# Altium project MIXR Power.PrjPcb (part 1 of 2)
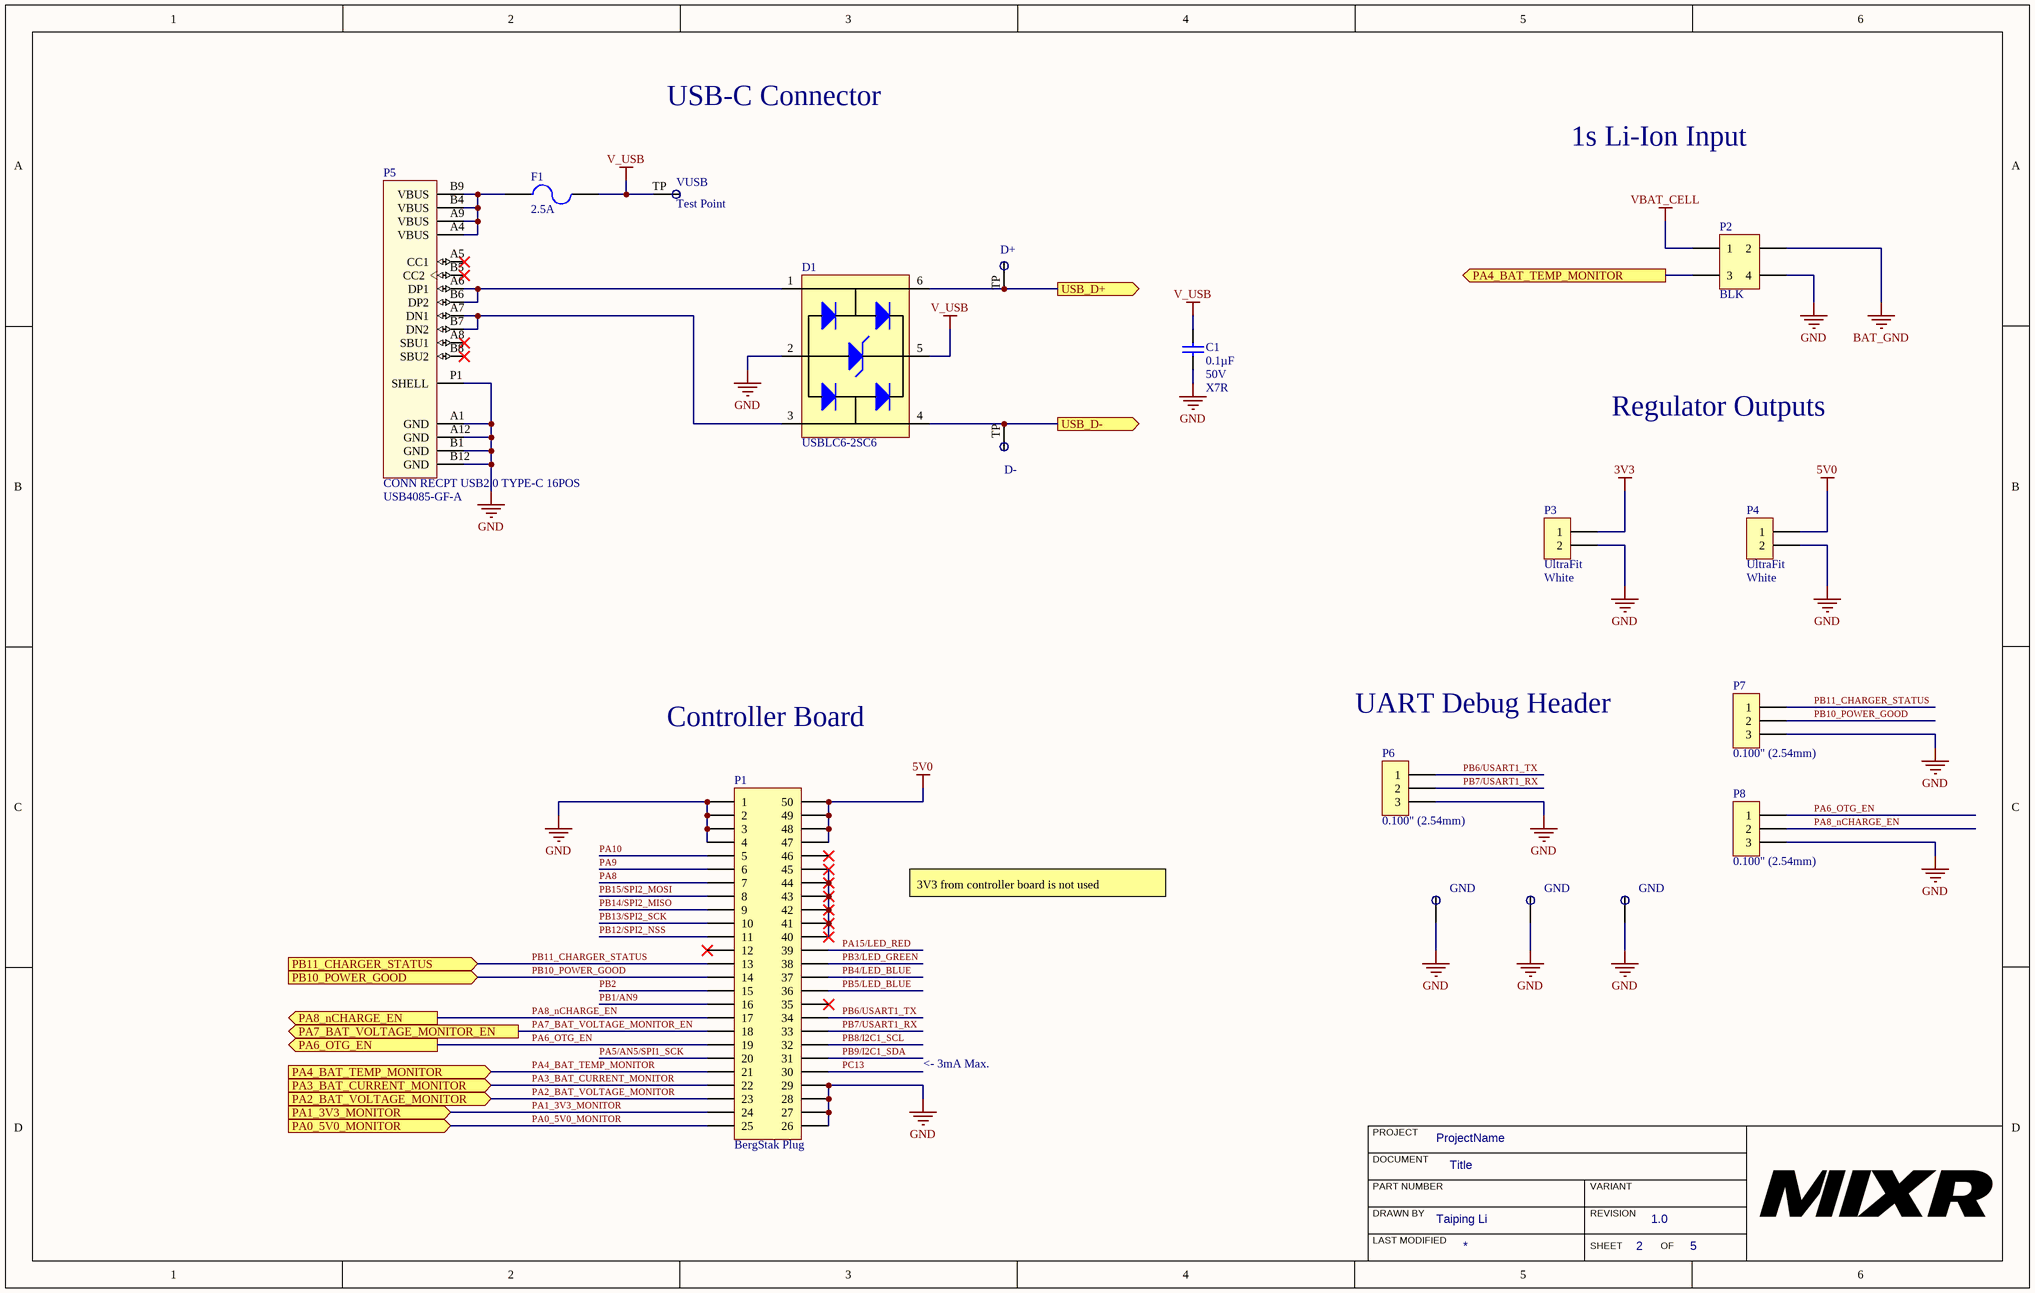
[diagram p0: MIXR Power - Connectors.SchDoc]
ProjectAuthor: Taiping Li; ProjectRevision: 1.0
5 sheets, 89 parts. Net scope: flat (ports and power ports of the same name join across sheets).
Board file: MIXR Power.PcbDoc
Sheets:
  MIXR Power - Block Diagram.SchDoc
  MIXR Power - Connectors.SchDoc
  MIXR Power - Battery Charging.SchDoc
  MIXR Power - Battery Management System.SchDoc
  MIXR Power - Regulators.SchDoc

## Sheet MIXR Power - Block Diagram.SchDoc: Title
size B; Organization: Midnight Sun Solar Rayce Car Team; Address1: University of Waterloo; Address2: 200 University Ave W; Address3: Waterloo, ON, Canada; Address4: N2L 3E9; DocumentNumber: 1; SheetNumber: 1; SheetTotal: 5; Website: www.uwmidsun.com; ProjectName: ProjectName

### Notes on the sheet
- PROJECT
- DOCUMENT
- DRAWN BY
- LAST MODIFIED
- PART NUMBER
- REVISION
- SHEET
- VARIANT
- OF

## Sheet MIXR Power - Connectors.SchDoc: Title
size B; Organization: Midnight Sun Solar Rayce Car Team; Address1: University of Waterloo; Address2: 200 University Ave W; Address3: Waterloo, ON, Canada; Address4: N2L 3E9; DocumentNumber: 2; SheetNumber: 2; SheetTotal: 5; Website: www.uwmidsun.com; ProjectName: ProjectName

### Parts
(Parts that share a designator on the sheet are numbered #1, #2 ... from top to bottom, then left to right.)
C1  Capacitance: 0.1µF  Voltage: 50V  Temperature Coefficient: X7R  [CAP, 0603]  (hidden comment: CAP CER 0.1UF 50V 10% X7R 0603)
D1  Manufacturer Part Number 1: USBLC6-2SC6  [SOT23-6]  (hidden comment: DIODE TVS 5.25V 17V SOT23-6)
D+  Test Point  [Test Point]  (value not drawn)  (no BOM)
D-  Test Point  [Test Point]  (value not drawn)  (no BOM)
F1  Current Rating: 2.5A  [FUSE LITTLEFUSE 0466 1206]  (hidden comment: FUSE 2.5A 32VDC 1206)
GND#1  Thru Test Point  [Thru Test Point]  (value not drawn)
GND#2  Thru Test Point  [Thru Test Point]  (value not drawn)
GND#3  Thru Test Point  [Thru Test Point]  (value not drawn)
P1  Series: BergStak Plug  [CONN, Bergstak 50 Pos Plug]  (hidden comment: CONN 50POS Bergstak Plug 0.02")
P2  BLK  [CONN, 4POS 2 ROW ULTRA-FIT]
P3  Series: UltraFit  Color: White  [CONN, 2POS ULTRA-FIT - NATURAL COLOR]  (hidden comment: CONN 2POS ULTRA-FIT NATURAL COLOR 0.138")
P4  Series: UltraFit  Color: White  [CONN, 2POS ULTRA-FIT - NATURAL COLOR]  (hidden comment: CONN 2POS ULTRA-FIT NATURAL COLOR 0.138")
P5  CONN RECPT USB2.0 TYPE-C 16POS  Manufacturer Part Number: USB4085-GF-A  [CONN RECPT USB2.0 TYPE C 16-POS]
P6  Pitch - Mating: 0.100" (2.54mm)  [CONN, 3POS 0.100" Header, 1 ROW]  (hidden comment: CONN 3POS HEADR MALE 0.1")
P7  Pitch - Mating: 0.100" (2.54mm)  [CONN, 3POS 0.100" Header, 1 ROW]  (hidden comment: CONN 3POS HEADR MALE 0.1")
P8  Pitch - Mating: 0.100" (2.54mm)  [CONN, 3POS 0.100" Header, 1 ROW]  (hidden comment: CONN 3POS HEADR MALE 0.1")
VUSB  Test Point  [Test Point]  (no BOM)

### Ports
PA0_5V0_MONITOR (in), PA1_3V3_MONITOR (in), PA2_BAT_VOLTAGE_MONITOR (in), PA3_BAT_CURRENT_MONITOR (in), PA4_BAT_TEMP_MONITOR (in), PA4_BAT_TEMP_MONITOR (out), PA6_OTG_EN (out), PA7_BAT_VOLTAGE_MONITOR_EN (out), PA8_nCHARGE_EN (out), PB10_POWER_GOOD (in), PB11_CHARGER_STATUS (in), USB_D+ (out), USB_D- (out)

### Nets
3V3: P3.1
5V0: P1.47 P1.48 P1.49 P1.50 P4.1
BAT_GND: P2.2
GND: C1.2 D1.2(Cathode2) GND#1.TH_TP GND#2.TH_TP GND#3.TH_TP P1.1 P1.2 P1.3 P1.4 P1.26 P1.27 P1.28 P1.29 P2.4 P3.2 P4.2 P5.A1(GND) P5.A12(GND) P5.B1(GND) P5.B12(GND) P5.P1(SHELL) P6.3 P7.3 P8.3
V_USB: C1.1 D1.5(Cathode4) F1.2 VUSB.TP
VBAT_CELL: P2.1
PA0_5V0_MONITOR: P1.25 ; port PA0_5V0_MONITOR
PA1_3V3_MONITOR: P1.24 ; port PA1_3V3_MONITOR
PA2_BAT_VOLTAGE_MONITOR: P1.23 ; port PA2_BAT_VOLTAGE_MONITOR
PA3_BAT_CURRENT_MONITOR: P1.22 ; port PA3_BAT_CURRENT_MONITOR
PA4_BAT_TEMP_MONITOR: P1.21 P2.3 ; port PA4_BAT_TEMP_MONITOR
PA5/AN5/SPI1_SCK: P1.20  [project net PA5/AN5/SPI1_SCK_2]
PA6_OTG_EN: P1.19 P8.1 ; port PA6_OTG_EN
PA7_BAT_VOLTAGE_MONITOR_EN: P1.18 ; port PA7_BAT_VOLTAGE_MONITOR_EN
PA8: P1.7  [project net PA8_2]
PA8_nCHARGE_EN: P1.17 P8.2 ; port PA8_nCHARGE_EN
PA9: P1.6  [project net PA9_2]
PA10: P1.5  [project net PA10_2]
PA15/LED_RED: P1.39  [project net PA15/LED_RED_2]
PB1/AN9: P1.16  [project net PB1/AN9_2]
PB2: P1.15  [project net PB2_2]
PB3/LED_GREEN: P1.38  [project net PB3/LED_GREEN_2]
PB4/LED_BLUE: P1.37  [project net PB4/LED_BLUE_2]
PB5/LED_BLUE: P1.36  [project net PB5/LED_BLUE_2]
PB6/USART1_TX: P1.34 P6.1  [project net PB6/USART1_TX_2]
PB7/USART1_RX: P1.33 P6.2  [project net PB7/USART1_RX_2]
PB8/I2C1_SCL: P1.32  [project net PB8/I2C1_SCL_2]
PB9/I2C1_SDA: P1.31  [project net PB9/I2C1_SDA_2]
PB10_POWER_GOOD: P1.14 P7.2 ; port PB10_POWER_GOOD
PB11_CHARGER_STATUS: P1.13 P7.1 ; port PB11_CHARGER_STATUS
PB12/SPI2_NSS: P1.11  [project net PB12/SPI2_NSS_2]
PB13/SPI2_SCK: P1.10  [project net PB13/SPI2_SCK_2]
PB14/SPI2_MISO: P1.9  [project net PB14/SPI2_MISO_2]
PB15/SPI2_MOSI: P1.8  [project net PB15/SPI2_MOSI_2]
PC13: P1.30  [project net PC13_2]
NetD1_1: D1.1(Cathode3) P5.A6(DP1) P5.B6(DP2)
NetD1_3: D1.3(Cathode1) P5.A7(DN1) P5.B7(DN2)
NetD1_4: D1.4(Cathode2) D-.TP ; port USB_D-
NetD1_6: D1.6(Cathode3) D+.TP ; port USB_D+
NetF1_1: F1.1 P5.A4(VBUS) P5.A9(VBUS) P5.B4(VBUS) P5.B9(VBUS)
NetP1_40: P1.40 P1.41 P1.42 P1.43 P1.44 P1.45

Not connected (* = marked no-connect by the designer): P1 12* 35* 46*; P5 A5(CC1)* A8(SBU1)* B5(CC2)* B8(SBU2)*

### Notes on the sheet
- USB-C Connector
- 1s Li-Ion Input
- Regulator Outputs
- Controller Board
- UART Debug Header
- 3V3 from controller board is not used
- <- 3mA Max.
- PROJECT
- DOCUMENT
- DRAWN BY
- LAST MODIFIED
- PART NUMBER
- REVISION
- SHEET
- VARIANT
- OF

### Library data of the parts
C1 = CAP CER 0.1UF 50V 10% X7R 0603: 0.10µF ±10% 50V Ceramic Capacitor X7R 0603 (1608 Metric); Manufacturer 1: AVX Corporation; Manufacturer Part Number 1: 06035C104KAT2A; Supplier 1: Digi-Key; Supplier Part Number 1: 478-5052-1-ND; Packaging: Cut Tape (CT); Part Status: Active; Operating Temperature: -55°C ~ 125°C; Ratings: -; Mounting Type: Surface Mount, MLCC; Package / Case: 0603 (1608 Metric); Size / Dimension: 0.063" L x 0.032" W (1.60mm x 0.81mm); Height - Seated (Max): -; Thickness (Max): 0.035" (0.90mm); Lead Spacing: -; Lead Style: -; ComponentLink1URL: http://datasheets.avx.com/X7RDielectric.pdf; ComponentLink1Description: http://datasheets.avx.com/X7RDielectric.pdf; Tolerance: ±10%
D1 = DIODE TVS 5.25V 17V SOT23-6: 17V Clamp 5A (8/20µs) Ipp Tvs Diode Surface Mount SOT-23-6; Manufacturer 1: STMicroelectronics; Data Rate: 480Mbps; Direction: Unidirectional; Capacitance: 3.5pF; Operating Supply Voltage: 1.1V; Number of Elements: 1; Number of Channels: 2; Reverse Breakdown Voltage: 6V; Working Voltage: 5V; Power Line Protection: Yes; Test Current: 1mA; Max Reverse Leakage Current: 150nA; Element Configuration: Dual; Supplier 1: Digi-Key; Stock 1: 7579; Pricing 1: 1=0.47000, 10=0.39900, 100=0.29820, 500=0.23430, 1000=0.18105 (USD); RoHS: Yes; Mount: Surface Mount; Case/Package: SOT-23; Number of Pins: 6; Contact Plating: Tin; Min Operating Temperature: -40°C; Max Operating Temperature: 125°C; Packaging: Tape and Reel; Package Quantity: 3000; Polarity: Unidirectional; Breakdown Voltage: 6V; Clamping Voltage: 17V; Termination: SMD/SMT; Number of Bidirectional Channels: 2; Reverse Standoff Voltage: 5.25V; Min Breakdown Voltage: 6V; ESD Protection: Yes; Max Breakdown Voltage: 6V; Leakage Current: 150nA; Peak Pulse Current: 5A; Length: 3.05mm; Height: 1.3mm; Width: 1.75mm; Depth: 1.75mm; Radiation Hardening: No; REACH SVHC: No SVHC; Lead Free: Lead Free; ComponentLink1URL: https://datasheet.ciiva.com/1268/1690354-1268384.pdf?src-supplier=Element14; ComponentLink1Description: https://datasheet.ciiva.com/1268/1690354-1268384.pdf?src-supplier=Element14; ComponentLink2URL: https://datasheet.ciiva.com/4508/cd00050750-113117-4508433.pdf?src-supplier=Mouser; ComponentLink2Description: https://datasheet.ciiva.com/4508/cd00050750-113117-4508433.pdf?src-supplier=Mouser; ComponentLink3URL: https://datasheet.ciiva.com/15143/getdatasheetpartid-148465-15143789.pdf?src-supplier=Verical; ComponentLink3Description: https://datasheet.ciiva.com/15143/getdatasheetpartid-148465-15143789.pdf?src-supplier=Verical; ComponentLink4URL: https://datasheet.ciiva.com/26787/usblc6-2sc6-26787908.pdf?src-supplier=IIIC; ComponentLink4Description: https://datasheet.ciiva.com/26787/usblc6-2sc6-26787908.pdf?src-supplier=IIIC; ComponentLink5URL: https://datasheet.ciiva.com/16200/cd00050750-16200026.pdf?src-supplier=Future+Electronics; ComponentLink5Description: https://datasheet.ciiva.com/16200/cd00050750-16200026.pdf?src-supplier=Future+Electronics; ComponentLink6URL: https://datasheet.ciiva.com/41444/001184109-da-01-en-ic-esd-protecti-usblc6-2sc6-sot-23-6-stm-41444156.pdf?src-supplier=Conrad; ComponentLink6Description: https://datasheet.ciiva.com/41444/001184109-da-01-en-ic-esd-protecti-usblc6-2sc6-sot-23-6-stm-41444156.pdf?src-supplier=Conrad; Supplier Part Number 1: 497-5235-1-ND
F1 = FUSE 2.5A 32VDC 1206: 2.5A 32V AC 32V DC Fuse Board Mount (Cartridge Style Excluded) Surface Mount 1206 (3216 Metric); Manufacturer 1: Littelfuse; Manufacturer Part Number 1: 046602.5NRHF; DC Cold Resistance: 24mR; Power Dissipation: 192.5mW; Approvals: UL; Supplier 1: Digi-Key; Stock 1: 4995; Pricing 1: 1=0.84000, 5=0.81200, 10=0.78700, 50=0.66180, 100=0.54930, 250=0.49940, 500=0.42450, 1000=0.37455 (USD); RoHS: Yes; Mount: Surface Mount; Case/Package: 1206; Case Code (Metric): 3216; Case Code (Imperial): 1206; Housing Material: Ceramic; Min Operating Temperature: -55°C; Max Operating Temperature: 90°C; Package Quantity: 5000; Voltage Rating (AC): 32V; Voltage Rating (DC): 32V; Packaging: Tape and Reel; Working Voltage: 32V; Fuse Type: Board Mount (Cartridge Style Excluded); Length: 3.18mm; Height: 0.023inch; Width: 0.06inch; Depth: 1.52mm; Lead Free: Lead Free; ComponentLink1URL: https://datasheet.ciiva.com/303/littelfuse-fuse-466-303217.pdf?src-supplier=Digi-Key; ComponentLink1Description: https://datasheet.ciiva.com/303/littelfuse-fuse-466-303217.pdf?src-supplier=Digi-Key; ComponentLink2URL: https://datasheet.ciiva.com/18652/littelfuse-fuse-466-datasheet-pdf-18652469.pdf?src-supplier=Digi-Key; ComponentLink2Description: https://datasheet.ciiva.com/18652/littelfuse-fuse-466-datasheet-pdf-18652469.pdf?src-supplier=Digi-Key; ComponentLink3URL: https://datasheet.ciiva.com/16327/littelfuse-fuse-466-16327471.pdf?src-supplier=Future+Electronics; ComponentLink3Description: https://datasheet.ciiva.com/16327/littelfuse-fuse-466-16327471.pdf?src-supplier=Future+Electronics; Supplier Part Number 1: F6143CT-ND
P1 = CONN 50POS Bergstak Plug 0.02": 50 Position Connector Plug, Outer Shroud Contacts Surface Mount Gold; Manufacturer 1: Amphenol FCI; Manufacturer Part Number 1: 10132797-055100LF; Number of Positions: 50; Mated Stacking Heights: 5mm; Pitch: 0.020" (0.50mm); Supplier 1: Digi-Key; Supplier Part Number 1: 609-5226-1-ND; Packaging: Cut Tape (CT); Part Status: Active; Connector Type: Plug, Outer Shroud Contacts; Number of Rows: 2; Mounting Type: Surface Mount; Contact Finish: Gold; Contact Finish Thickness: 1µin (0.025µm); Height Above Board: 0.169" (4.30mm); ComponentLink1URL: http://portal.fciconnect.com/Comergent//fci/drawing/10132797.pdf; ComponentLink1Description: http://portal.fciconnect.com/Comergent//fci/drawing/10132797.pdf
P2 = CONN 4POS 2 ROW ULTRA-FIT 0.138": Connector Header Through Hole 4 position 0.138" (3.50mm); Manufacturer 1: Molex; Manufacturer Part Number 1: 1722991104; Description 1: ULTRA-FIT HDR VT DUAL F BLK 04CKT TIN; Number of Positions: 4; Connector Type: Male Pin; Pitch: 0.138inch; Row Spacing: 0.181inch; Supplier 1: Digi-Key; Supplier Part Number 1: WM11777-ND; Stock 1: 958; Pricing 1: 1=0.86, 10=0.753, 100=0.6494, 500=0.53136, 1000=0.47232, 5000=0.41328, 10000=0.39262 (USD); Mount: Through Hole; Colour: Black; Contact Plating: Tin; Packaging: Tray; Number of Rows: 2; Termination: Solder; Fastening Type: Latch; ComponentLink1URL: http://www.literature.molex.com/SQLImages/kelmscott/Molex/PDF_Images/987651-1008.pdf; ComponentLink1Description: http://www.literature.molex.com/SQLImages/kelmscott/Molex/PDF_Images/987651-1008.pdf
P3 P4 = CONN 2POS ULTRA-FIT NATURAL COLOR 0.138": 2 Positions Header, Shrouded Connector 0.138" (3.50mm) Through Hole; Manufacturer 1: Molex, LLC; Manufacturer Part Number 1: 1722872102; Style: Board to Cable/Wire; Shrouding: Shrouded - 4 Wall; Number of Positions: 2; Number of Positions Loaded: All; Contact Length - Post: 0.126" (3.20mm); Material Flammability Rating: UL94 V-0; Mated Stacking Heights: 26.99mm; Voltage: 400V; Supplier 1: Digi-Key; Supplier Part Number 1: WM11722-ND; Packaging: Tray; Part Status: Active; Connector Type: Header; Contact Type: Male Pin; Pitch - Mating: 0.138" (3.50mm); Number of Rows: 1; Row Spacing - Mating: -; Mounting Type: Through Hole; Termination: Solder; Fastening Type: Latch Holder; Contact Length - Mating: -; Overall Contact Length: -; Insulation Height: 0.465" (11.80mm); Contact Shape: Square; Contact Finish - Mating: Tin; Contact Finish Thickness - Mating: 60µin (1.52µm); Contact Finish - Post: Tin; Contact Material: Copper Alloy; Insulation Material: Liquid Crystal Polymer (LCP); Operating Temperature: -40°C ~ 105°C; Ingress Protection: -; Insulation Color: Natural; Current Rating: -; Contact Finish Thickness - Post: 60µin (1.52µm); ComponentLink1URL: http://www.molex.com/pdm_docs/sd/1722872102_sd.pdf; ComponentLink1Description: http://www.molex.com/pdm_docs/sd/1722872102_sd.pdf
P5 = CONN RECPT USB2.0 TYPE-C 16POS: USB - C USB 2.0 Receptacle Connector 16 Position Through Hole, Right Angle; Manufacturer: Global Connector Technology; Supplier 1: Digi-Key; Supplier Part Number 1: 2073-USB4085-GF-ACT-ND; Stock 1: 286; Pricing 1: 1 = 1.440000, 10 = 1.307000, 25 = 1.227200, 50 = 1.174000, 100 = 1.120600, 250 = 1.013840 (USD); RoHS: No
P6-P8 = CONN 3POS HEADR MALE 0.1": 3 Positions Header Connector 0.100" (2.54mm) Through Hole Gold; Manufacturer 1: Wurth Electronics Inc.; Manufacturer Part Number 1: 61300311121; Style: Board to Board or Cable; Shrouding: Unshrouded; Number of Positions: 3; Number of Positions Loaded: All; Contact Length - Mating: 0.236" (6.00mm); Contact Length - Post: 0.118" (3.00mm); Overall Contact Length: 0.454" (11.54mm); Material Flammability Rating: UL94 V-0; Current Rating: 3A; Voltage: 250V; Supplier 1: Digi-Key; Supplier Part Number 1: 732-5316-ND; Packaging: Bulk; Part Status: Active; Connector Type: Header; Contact Type: Male Pin; Number of Rows: 1; Row Spacing - Mating: -; Mounting Type: Through Hole; Termination: Solder; Fastening Type: -; Insulation Height: 0.100" (2.54mm); Contact Shape: Square; Contact Finish - Mating: Gold; Contact Finish Thickness - Mating: -; Contact Finish - Post: -; Contact Material: Copper Alloy; Insulation Material: Polybutylene Terephthalate (PBT); Operating Temperature: -40°C ~ 125°C; Ingress Protection: -; Insulation Color: Black; Mated Stacking Heights: -; Contact Finish Thickness - Post: -; ComponentLink1URL: http://katalog.we-online.de/em/datasheet/6130xx11121.pdf; ComponentLink1Description: http://katalog.we-online.de/em/datasheet/6130xx11121.pdf

## Sheet MIXR Power - Battery Charging.SchDoc: Title
size B; Organization: Midnight Sun Solar Rayce Car Team; Address1: University of Waterloo; Address2: 200 University Ave W; Address3: Waterloo, ON, Canada; Address4: N2L 3E9; DocumentNumber: 3; SheetNumber: 3; SheetTotal: 5; Website: www.uwmidsun.com; ProjectName: ProjectName
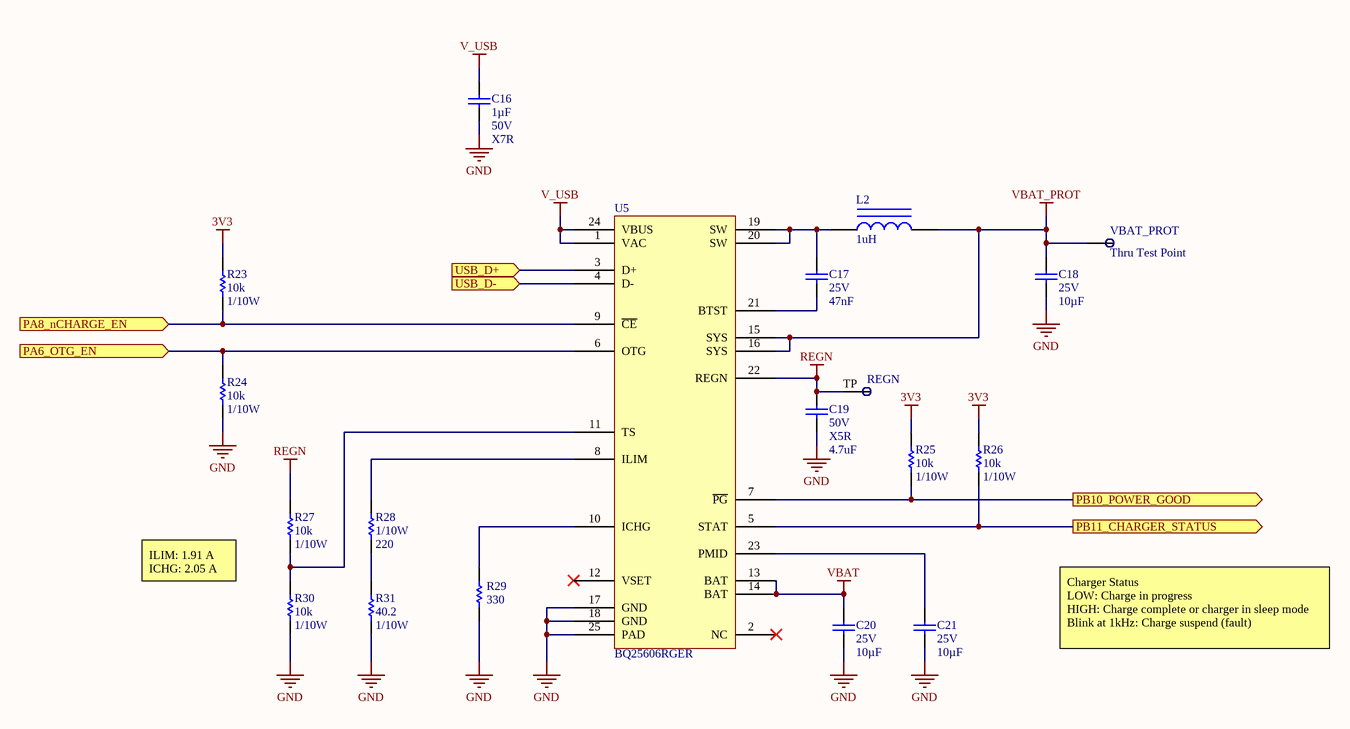
[diagram p1: MIXR Power - Battery Charging.SchDoc]

### Parts
C16  Capacitance: 1µF  Voltage: 50V  Temperature Coefficient: X7R  [CAP, 0603]  (hidden comment: CAP CER 1UF 50V 10% X7R 0603)
C17  Voltage: 25V  Capacitance: 47nF  [CAP, 0603]  (hidden comment: CAP CER 0.047UF 10% 25V X7R 0603)
C18  Voltage - Rated: 25V  Capacitance: 10µF  [CAP, 0805]  (hidden comment: CAP CER 10uF 25V 10% X5R 0805)
C19  value 4.7uF  Voltage - Rated: 50V  Temperature Coefficient: X5R  [CAP, 0805]  (hidden comment: CAP CER 4.7UF 50V 10% X5R 0805)
C20  Voltage - Rated: 25V  Capacitance: 10µF  [CAP, 0805]  (hidden comment: CAP CER 10uF 25V 10% X5R 0805)
C21  Voltage - Rated: 25V  Capacitance: 10µF  [CAP, 0805]  (hidden comment: CAP CER 10uF 25V 10% X5R 0805)
L2  Inductance: 1uH  [IND 1uH 3.8A 25 MOHM SMD]  (hidden comment: IND 1uH 3.8A 25 MOHM SMD)
R23  Resistance: 10k  Power: 1/10W  [RES, 0603]  (hidden comment: RES 10K OHM 1% 1/10W 0603)
R24  Resistance: 10k  Power: 1/10W  [RES, 0603]  (hidden comment: RES 10K OHM 1% 1/10W 0603)
R25  Resistance: 10k  Power: 1/10W  [RES, 0603]  (hidden comment: RES 10K OHM 1% 1/10W 0603)
R26  Resistance: 10k  Power: 1/10W  [RES, 0603]  (hidden comment: RES 10K OHM 1% 1/10W 0603)
R27  Resistance: 10k  Power: 1/10W  [RES, 0603]  (hidden comment: RES 10K OHM 1% 1/10W 0603)
R28  Power (Watts): 1/10W  Resistance: 220  [RES, 0603]  (hidden comment: RES 220 OHM 1% 1/10W 0603)
R29  value 330  [RES, 0603]  (hidden comment: RES 330 OHM 1% 1/10W 0603)
R30  Resistance: 10k  Power: 1/10W  [RES, 0603]  (hidden comment: RES 10K OHM 1% 1/10W 0603)
R31  Resistance: 40.2  Power: 1/10W  [RES, 0603]  (hidden comment: RES 40.2 OHM 0.5% 1/10W 0603)
REGN  Test Point  [Test Point]  (value not drawn)  (no BOM)
U5  Manufacturer Part Number: BQ25606RGER  [IC BATT CHG LI-ION 1 CELL 24-VQFN]  (hidden comment: IC BATT CHG LI-ION 1 CELL 24-VQFN)
VBAT_PROT  Thru Test Point  [Thru Test Point]

### Ports
PA6_OTG_EN (in), PA8_nCHARGE_EN (in), PB10_POWER_GOOD (out), PB11_CHARGER_STATUS (out), USB_D+ (in), USB_D- (in)

### Nets
3V3: R23.1 R25.1 R26.1
GND: C16.2 C18.2 C19.2 C20.2 C21.2 R24.2 R29.2 R30.2 R31.2 U5.17(GND) U5.18(GND) U5.25(PAD)
REGN: C19.1 R27.1 REGN.TP U5.22(REGN)
V_USB: C16.1 U5.1(VAC) U5.24(VBUS)
VBAT: C20.1 U5.13(BAT) U5.14(BAT)
VBAT_PROT: C18.1 L2.2 U5.15(SYS) U5.16(SYS) VBAT_PROT.TH_TP
PA6_OTG_EN: R24.1 U5.6(OTG) ; port PA6_OTG_EN
PA8_nCHARGE_EN: R23.2 U5.9(~{CE}) ; port PA8_nCHARGE_EN
PB10_POWER_GOOD: R25.2 U5.7(~{PG}) ; port PB10_POWER_GOOD
PB11_CHARGER_STATUS: R26.2 U5.5(STAT) ; port PB11_CHARGER_STATUS
NetC17_1: C17.1 L2.1 U5.19(SW) U5.20(SW)
NetC17_2: C17.2 U5.21(BTST)
NetC21_1: C21.1 U5.23(PMID)
NetD1_4: U5.4(D-) ; port USB_D-
NetD1_6: U5.3(D+) ; port USB_D+
NetR27_2: R27.2 R30.1 U5.11(TS)
NetR28_1: R28.1 U5.8(ILIM)
NetR28_2: R28.2 R31.1
NetR29_1: R29.1 U5.10(ICHG)

Not connected (* = marked no-connect by the designer): U5 2(NC)* 12(VSET)*

### Notes on the sheet
- ILIM: 1.91 A
  ICHG: 2.05 A
- Charger Status
  LOW: Charge in progress
  HIGH: Charge complete or charger in sleep mode
  Blink at 1kHz: Charge suspend (fault)
- PROJECT
- DOCUMENT
- DRAWN BY
- LAST MODIFIED
- PART NUMBER
- REVISION
- SHEET
- VARIANT
- OF

### Library data of the parts
C16 = CAP CER 1UF 50V 10% X7R 0603: 1µF ±10% 50V Ceramic Capacitor X7R 0603 (1608 Metric); Manufacturer 1: Taiyo Yuden; Manufacturer Part Number 1: UMK107AB7105KA-T; Supplier 1: Digi-Key; Supplier Part Number 1: 587-3247-1-ND; Packaging: Cut Tape (CT); Part Status: Active; Operating Temperature: -55°C ~ 125°C; Ratings: -; Mounting Type: Surface Mount, MLCC; Package / Case: 0603 (1608 Metric); Size / Dimension: 0.063" L x 0.031" W (1.60mm x 0.80mm); Height - Seated (Max): -; Thickness (Max): 0.037" (0.95mm); Lead Spacing: -; Lead Style: -; ComponentLink1URL: http://www.yuden.co.jp/productdata/catalog/en/mlcc_all_e.pdf; ComponentLink1Description: http://www.yuden.co.jp/productdata/catalog/en/mlcc_all_e.pdf; Tolerance: ±10%
C17 = CAP CER 0.047UF 10% 25V X7R 0603: 0.047µF ±10% 25V Ceramic Capacitor X7R 0603 (1608 Metric) /; Manufacturer: KEMET; Manufacturer Part Number: C0603C473K3RACTU; Supplier 1: Digi-Key; Supplier Part Number 1: 399-7931-1-ND; Stock 1: 1163581; Pricing 1: 1 = 0.11000, 10 = 0.07800, 100 = 0.03650, 500 = 0.02562, 1000 = 0.02121 (USD); RoHS: Yes; Mount: Surface Mount; Case/Package: 0603; Dielectric Material: Ceramic; Contact Plating: Tin; Min Operating Temperature: -55°C; Max Operating Temperature: 125°C; Tolerance: 10%; Packaging: Tape and Reel; Dielectric: X7R; Termination: SMD/SMT; Voltage Rating (DC): 25V; Length: 1.6mm; Height: 0.8mm; Depth: 0.8mm; Radiation Hardening: No; ComponentLink1URL: https://datasheet.ciiva.com/28682/1851736-28682293.pdf?src-supplier=Element14; ComponentLink1Description: https://datasheet.ciiva.com/28682/1851736-28682293.pdf?src-supplier=Element14; ComponentLink2URL: https://datasheet.ciiva.com/28584/1918693-28584138.pdf?src-supplier=Element14; ComponentLink2Description: https://datasheet.ciiva.com/28584/1918693-28584138.pdf?src-supplier=Element14; ComponentLink3URL: https://datasheet.ciiva.com/46445/1851736-46445227.pdf?src-supplier=Element14; ComponentLink3Description: https://datasheet.ciiva.com/46445/1851736-46445227.pdf?src-supplier=Element14; ComponentLink4URL: https://datasheet.ciiva.com/18193/getdatasheetpartid-330260-18193100.pdf?src-supplier=Verical; ComponentLink4Description: https://datasheet.ciiva.com/18193/getdatasheetpartid-330260-18193100.pdf?src-supplier=Verical; ComponentLink5URL: https://datasheet.ciiva.com/7824/kem-c1002-x7r-smd-7824045.pdf?src-supplier=Element14; ComponentLink5Description: https://datasheet.ciiva.com/7824/kem-c1002-x7r-smd-7824045.pdf?src-supplier=Element14
C18 C20 C21 = CAP CER 10uF 25V 10% X5R 0805: 10µF ±10% 25V Ceramic Capacitor X5R 0805 (2012 Metric); Manufacturer: Murata Electronics North America; Manufacturer Part Number: GRM21BR61E106KA73L; Supplier 1: Digi-Key; RoHS: RoHS Compliant; Category: Capacitors; Stock 1: 1695157; Packaging: Cut Tape (CT); Part Status: Active; Tolerance: ±10%; Temperature Coefficient: X5R; Operating Temperature: -55°C ~ 85°C; Features: -; Ratings: -; Applications: General Purpose; Mounting Type: Surface Mount, MLCC; Package / Case: 0805 (2012 Metric); Size / Dimension: 0.079" L x 0.049" W (2.00mm x 1.25mm); Height - Seated (Max): -; Thickness (Max): 0.053" (1.35mm); Lead Spacing: -; Lead Style: -; ComponentLink1URL: http://search.murata.co.jp/Ceramy/image/img/A01X/G101/ENG/GRM21BR61E106KA73-01.pdf; ComponentLink1Description: http://search.murata.co.jp/Ceramy/image/img/A01X/G101/ENG/GRM21BR61E106KA73-01.pdf; Supplier Part Number 1: 490-5523-1-ND; Pricing 1: 1=0.3, 10=0.214, 100=0.1008, 500=0.07068, 1000=0.05851 (CAD)
C19 = CAP CER 4.7UF 50V 10% X5R 0805: 4.7µF ±20% 50V Ceramic Capacitor X5R 0805 (2012 Metric); Manufacturer 1: Murata Electronics North America; Manufacturer Part Number 1: GRT21BR61H475ME13L; Description 1: CAP CER 4.7UF 50V X5R 0805; Supplier 1: Digi-Key; Supplier Part Number 1: 490-12395-1-ND; RoHS: RoHS Compliant; Category: Capacitors; Stock 1: 4286; Pricing 1: 1=0.56, 10=0.389, 100=0.2338, 500=0.17536, 1000=0.14808 (CAD); Packaging: Cut Tape (CT); Part Status: Active; Tolerance: ±20%; Operating Temperature: -55°C ~ 85°C; Features: -; Ratings: AEC-Q200; Applications: Automotive; Mounting Type: Surface Mount, MLCC; Package / Case: 0805 (2012 Metric); Size / Dimension: 0.079" L x 0.049" W (2.00mm x 1.25mm); Height - Seated (Max): -; Thickness (Max): 0.057" (1.45mm); Lead Spacing: -; Lead Style: -; ComponentLink1URL: http://search.murata.co.jp/Ceramy/image/img/A01X/G101/ENG/GRT21BR61H475ME13-01.pdf; ComponentLink1Description: http://search.murata.co.jp/Ceramy/image/img/A01X/G101/ENG/GRT21BR61H475ME13-01.pdf
L2 = IND 1uH 3.8A 25 MOHM SMD: 1µH Shielded Inductor 3.8A 25mOhm Max Nonstandard /; Manufacturer: Vishay Dale; Manufacturer Part Number: IFSC1515AHER1R0M01; Tolerance: 20%; DC Resistance (DCR): 25mR; Test Frequency: 100kHz; Supplier 1: Digi-Key; Supplier Part Number 1: 541-1403-1-ND; Stock 1: 59210; Pricing 1: 1 = 0.64000, 10 = 0.55900, 100 = 0.39960, 500 = 0.33568, 1000 = 0.27175 (USD); RoHS: Yes; Mount: Surface Mount; Case/Package: 1515; Number of Pins: 2; Min Operating Temperature: -55°C; Max Operating Temperature: 125°C; Package Quantity: 2000; Current Rating: 3.8A; Saturation Current: 3.8A; Shielding: Shielded; Packaging: Tape and Reel; Inductance Tolerance: 20%; Max DC Current: 3.8A; Termination: SMD/SMT; RMS Current (Irms): 3.8A; Military Standard: Not; Length: 0.15inch; Height: 1.8mm; Width: 0.15inch; Height - Seated (Max): 0.075inch; Depth: 4mm; REACH SVHC: Unknown; Lead Free: Lead Free; ComponentLink1URL: https://datasheet.ciiva.com/1049/sc15ah01-1049408.pdf?src-supplier=Digi-Key; ComponentLink1Description: https://datasheet.ciiva.com/1049/sc15ah01-1049408.pdf?src-supplier=Digi-Key; ComponentLink2URL: https://datasheet.ciiva.com/1049/sc15ah01-1049409.pdf?src-supplier=Digi-Key; ComponentLink2Description: https://datasheet.ciiva.com/1049/sc15ah01-1049409.pdf?src-supplier=Digi-Key; ComponentLink3URL: https://datasheet.ciiva.com/3079/sc15ah01-3079157.pdf?src-supplier=Avnet; ComponentLink3Description: https://datasheet.ciiva.com/3079/sc15ah01-3079157.pdf?src-supplier=Avnet; ComponentLink4URL: https://datasheet.ciiva.com/1049/sc15ah01-1049407.pdf?src-supplier=Digi-Key; ComponentLink4Description: https://datasheet.ciiva.com/1049/sc15ah01-1049407.pdf?src-supplier=Digi-Key; ComponentLink5URL: https://datasheet.ciiva.com/8017/sc15ah01-8017535.pdf?src-supplier=Element14; ComponentLink5Description: https://datasheet.ciiva.com/8017/sc15ah01-8017535.pdf?src-supplier=Element14
R23-R27 R30 = RES 10K OHM 1% 1/10W 0603: RES SMD 10K OHM 1% 1/10W 0603; Manufacturer 1: Yageo; Manufacturer Part Number 1: RC0603FR-0710KL; Temperature Coefficient: ±100ppm/°C; Supplier 1: Digi-Key; Supplier Part Number 1: 311-10.0KHRCT-ND; Packaging: Cut Tape (CT); Part Status: Active; Composition: Thick Film; Operating Temperature: -55°C ~ 155°C; Package / Case: 0603 (1608 Metric); Supplier Device Package: 0603; Size / Dimension: 0.063" L x 0.031" W (1.60mm x 0.80mm); Height - Seated (Max): 0.022" (0.55mm); Failure Rate: -; ComponentLink1URL: http://www.yageo.com/documents/recent/PYu-RC_Group_51_RoHS_L_7.pdf; ComponentLink1Description: http://www.yageo.com/documents/recent/PYu-RC_Group_51_RoHS_L_7.pdf; Tolerance: ±1%
R28 = RES 220 OHM 1% 1/10W 0603: 220 Ohms ±1% 0.1W, 1/10W Chip Resistor 0603 (1608 Metric) Moisture Resistant Thick Film; Manufacturer: Yageo; Manufacturer Part Number: RC0603FR-07220RL; Temperature Coefficient: ±100ppm/°C; Supplier 1: Digi-Key; RoHS: RoHS Compliant; Category: Resistors; Stock 1: 1318812; Pricing 1: 1=0.15, 10=0.022, 100=0.0088, 1000=0.00392, 2500=0.0034 (CAD); Packaging: Cut Tape (CT); Part Status: Active; Tolerance: ±1%; Composition: Thick Film; Features: Moisture Resistant; Operating Temperature: -55°C ~ 155°C; Package / Case: 0603 (1608 Metric); Supplier Device Package: 0603; Size / Dimension: 0.063" L x 0.032" W (1.60mm x 0.80mm); Height - Seated (Max): 0.022" (0.55mm); Failure Rate: -; ComponentLink1URL: http://www.yageo.com/documents/recent/PYu-RC_Group_51_RoHS_L_8.pdf; ComponentLink1Description: http://www.yageo.com/documents/recent/PYu-RC_Group_51_RoHS_L_8.pdf; Supplier Part Number 1: 311-220HRCT-ND
R29 = RES 330 OHM 1% 1/10W 0603: 330 Ohms ±1% 0.1W, 1/10W Chip Resistor 0603 (1608 Metric) Automotive AEC-Q200, Moisture Resistant Thick Film; Manufacturer: TE Connectivity; Manufacturer Part Number: CRGCQ0603F330R; Supplier 1: Digi-Key; Supplier Part Number 1: A129682CT-ND; RoHS: No; Stock 1: 87700; Pricing 1: 1 = 0.10000, 10 = 0.03300, 100 = 0.01320, 1000 = 0.00595, 2500 = 0.00516 (USD); ComponentLink1URL: http://www.te.com/commerce/DocumentDelivery/DDEController?Action=srchrtrv&DocNm=1773204-3&DocType=DS&DocLang=English&src-supplier=Digi-Key; ComponentLink1Description: http://www.te.com/commerce/DocumentDelivery/DDEController?Action=srchrtrv&DocNm=1773204-3&DocType=DS&DocLang=English&src-supplier=Digi-Key; ComponentLink2URL: https://www.te.com/commerce/DocumentDelivery/DDEController?Action=srchrtrv&DocNm=1773204-3&DocType=DS&DocLang=English&src-supplier=Digi-Key; ComponentLink2Description: https://www.te.com/commerce/DocumentDelivery/DDEController?Action=srchrtrv&DocNm=1773204-3&DocType=DS&DocLang=English&src-supplier=Digi-Key
R31 = RES 40.2 OHM 0.5% 1/10W 0603: RES SMD 40.2 OHM 0.5% 1/10W 0603; Manufacturer 1: Yageo; Manufacturer Part Number 1: RT0603DRE0740R2L; Temperature Coefficient: ±50ppm/°C; Supplier 1: Digi-Key; Supplier Part Number 1: 311-2576-1-ND; Packaging: Cut Tape (CT); Part Status: Active; Composition: Thin Film; Operating Temperature: -55°C ~ 155°C; Package / Case: 0603 (1608 Metric); Supplier Device Package: 0603; Size / Dimension: 0.063" L x 0.031" W (1.60mm x 0.80mm); Height - Seated (Max): 0.022" (0.55mm); Failure Rate: -; ComponentLink1URL: http://www.yageo.com/documents/recent/PYu-RT_1-to-0.01_RoHS_L_7.pdf; ComponentLink1Description: http://www.yageo.com/documents/recent/PYu-RT_1-to-0.01_RoHS_L_7.pdf; Tolerance: ±0.5%
U5 = IC BATT CHG LI-ION 1 CELL 24-VQFN: Charger IC Lithium Ion/Polymer 24-VQFN (4x4); Manufacturer: Texas Instruments; Number of Cells: 1; Supplier 1: Digi-Key; Supplier Part Number 1: 296-47743-1-ND; Stock 1: 8983; Pricing 1: 1 = 2.76000, 10 = 2.48100, 100 = 2.03260, 500 = 1.73032, 1000 = 1.45930 (USD); RoHS: No; ComponentLink1URL: http://www.ti.com/lit/ds/symlink/bq25606.pdf?src-supplier=Digi-Key; ComponentLink1Description: http://www.ti.com/lit/ds/symlink/bq25606.pdf?src-supplier=Digi-Key

## Sheet MIXR Power - Battery Management System.SchDoc: Title
size B; Organization: Midnight Sun Solar Rayce Car Team; Address1: University of Waterloo; Address2: 200 University Ave W; Address3: Waterloo, ON, Canada; Address4: N2L 3E9; Website: www.uwmidsun.com; ProjectName: ProjectName
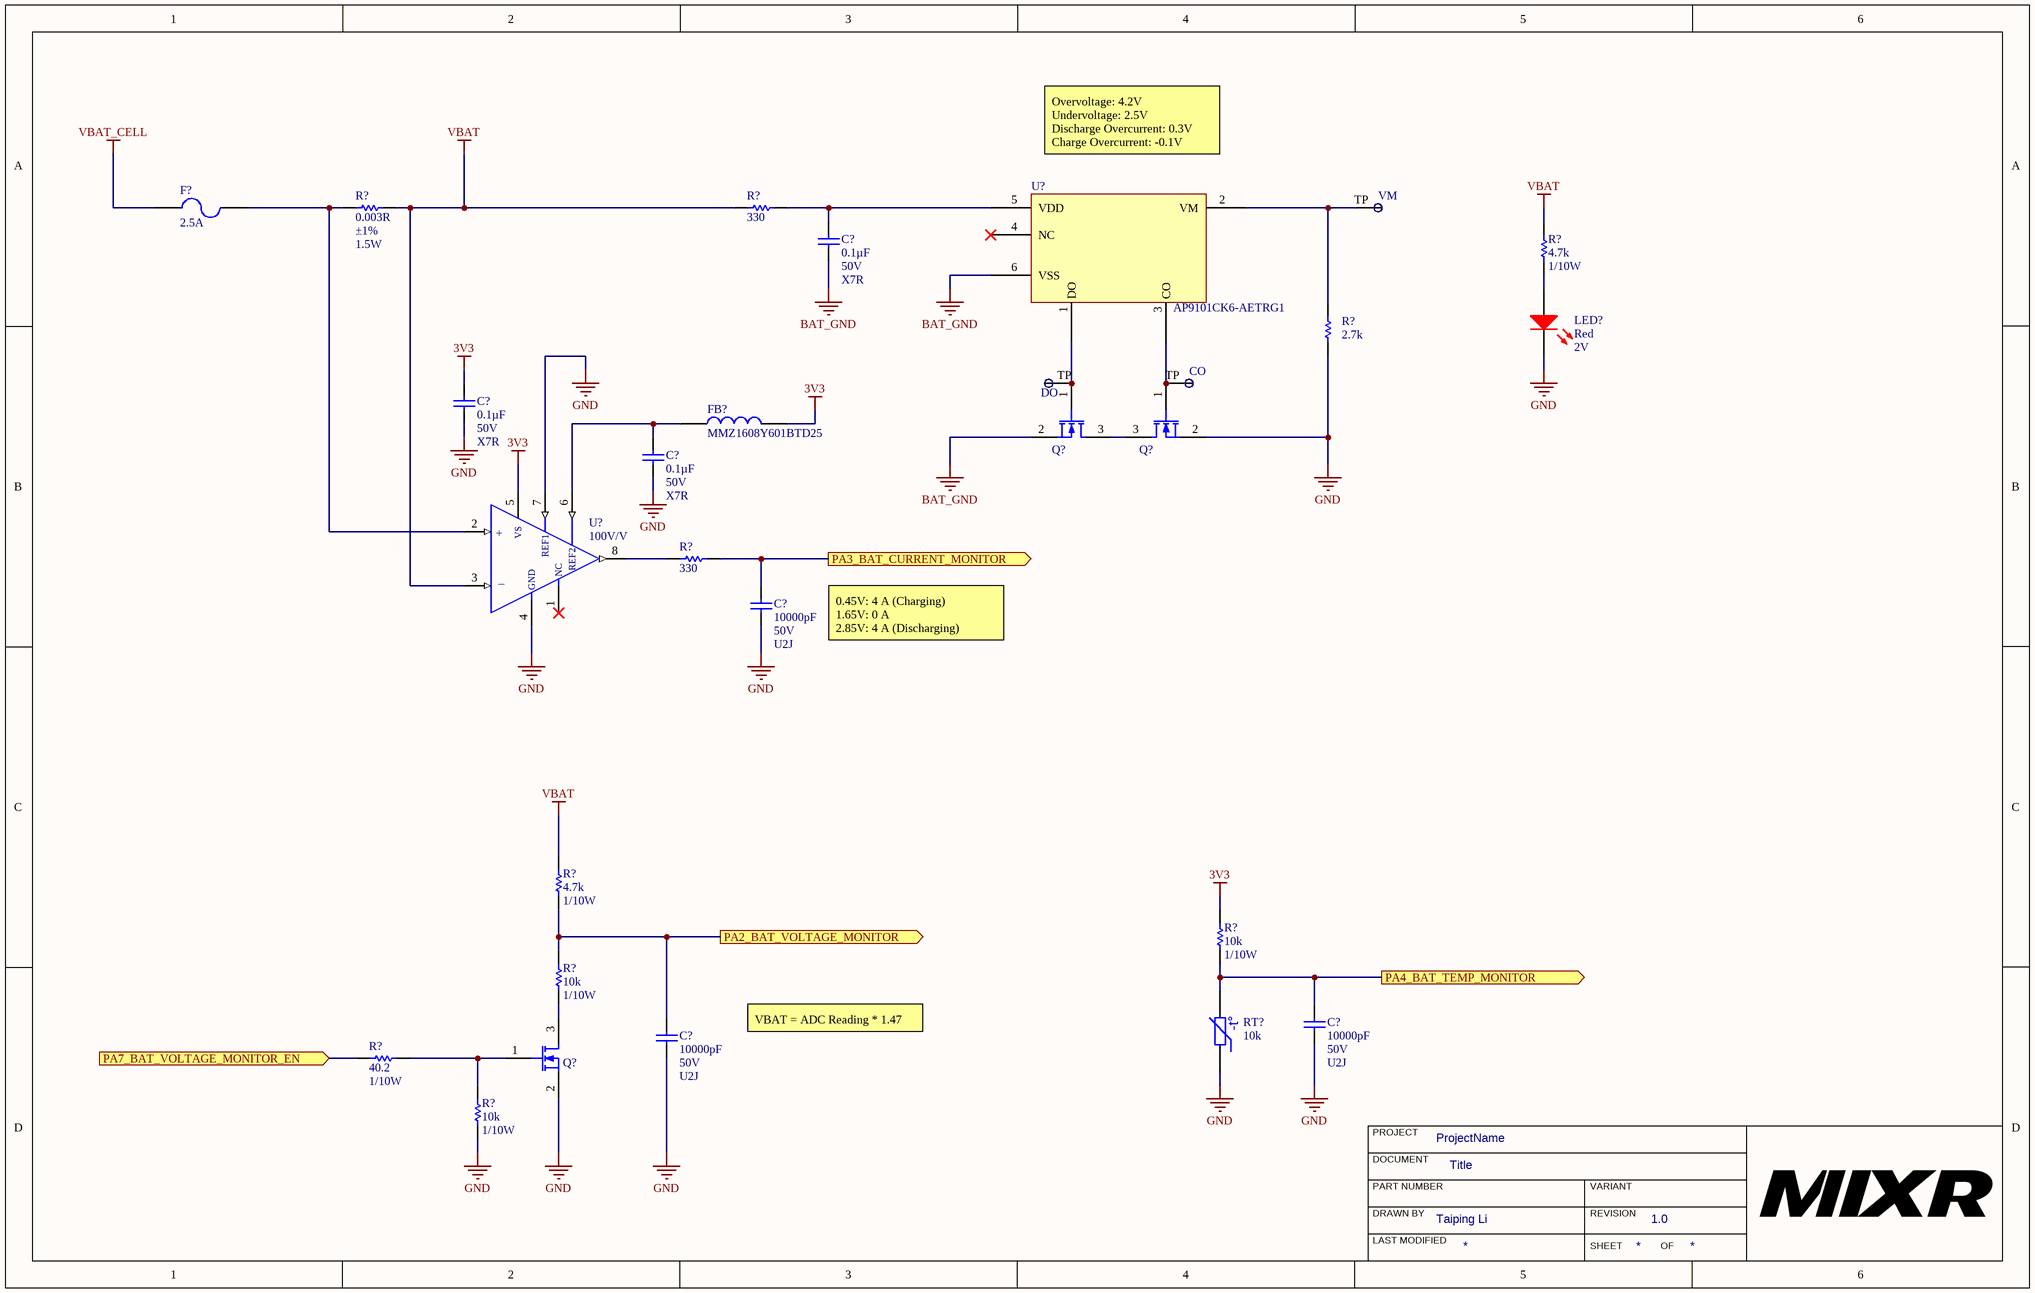
[diagram p2: MIXR Power - Battery Management System.SchDoc]

### Parts
(Parts that share a designator on the sheet are numbered #1, #2 ... from top to bottom, then left to right.)
C?#1  Capacitance: 0.1µF  Voltage: 50V  Temperature Coefficient: X7R  [CAP, 0603]  (hidden comment: CAP CER 0.1UF 50V 10% X7R 0603)
C?#2  Capacitance: 0.1µF  Voltage: 50V  Temperature Coefficient: X7R  [CAP, 0603]  (hidden comment: CAP CER 0.1UF 50V 10% X7R 0603)
C?#3  Capacitance: 0.1µF  Voltage: 50V  Temperature Coefficient: X7R  [CAP, 0603]  (hidden comment: CAP CER 0.1UF 50V 10% X7R 0603)
C?#4  Capacitance: 10000pF  Voltage: 50V  Temperature Coefficient: U2J  [CAP, 0603]  (hidden comment: CAP CER 10nF 50V 5% X7R 0603)
C?#5  Capacitance: 10000pF  Voltage: 50V  Temperature Coefficient: U2J  [CAP, 0603]  (hidden comment: CAP CER 10nF 50V 5% X7R 0603)
C?#6  Capacitance: 10000pF  Voltage: 50V  Temperature Coefficient: U2J  [CAP, 0603]  (hidden comment: CAP CER 10nF 50V 5% X7R 0603)
CO  Test Point  [Test Point]  (value not drawn)  (no BOM)
DO  Test Point  [Test Point]  (value not drawn)  (no BOM)
F?  Current Rating: 2.5A  [FUSE LITTLEFUSE 0466 1206]  (hidden comment: FUSE 2.5A 32VDC 1206)
FB?  Manufacturer Part Number: MMZ1608Y601BTD25  [FB 0603]  (hidden comment: FB 600 OHM 1LN 0603)
LED?#1  Color: Red  Voltage - Forward (Vf) (Typ): 2V  [LED_0603]  (hidden comment: LED RED CLEAR 2V 0603)
Q?#1  MOSFET N-CH 30V 6.2A 0.9W SOT-23  [MOSFET N-CH 30V 6.2A 0.9W SOT-23]  (value not drawn)
Q?#2  MOSFET N-CH 30V 6.2A 0.9W SOT-23  [MOSFET N-CH 30V 6.2A 0.9W SOT-23]  (value not drawn)
Q?#3  MOSFET N-CH 30V 6.2A 0.9W SOT-23  [MOSFET N-CH 30V 6.2A 0.9W SOT-23]  (value not drawn)
R?#1  Resistance (Ohms): 0.003R  Tolerance: ±1%  Power (Watts): 1.5W  [RES 2010]  (hidden comment: RES 0.003 OHM 1% 1.5W 2010)
R?#2  value 330  [RES, 0603]  (hidden comment: RES 330 OHM 1% 1/10W 0603)
R?#3  Resistance (Ohms): 4.7k  Power (Watts): 1/10W  [RES, 0603]  (hidden comment: RES 4.7K OHM 1% 1/10W 0603)
R?#4  2.7k  [RES, 0603]
R?#5  value 330  [RES, 0603]  (hidden comment: RES 330 OHM 1% 1/10W 0603)
R?#6  Resistance (Ohms): 4.7k  Power (Watts): 1/10W  [RES, 0603]  (hidden comment: RES 4.7K OHM 1% 1/10W 0603)
R?#7  Resistance: 10k  Power: 1/10W  [RES, 0603]  (hidden comment: RES 10K OHM 1% 1/10W 0603)
R?#8  Resistance: 10k  Power: 1/10W  [RES, 0603]  (hidden comment: RES 10K OHM 1% 1/10W 0603)
R?#9  Resistance: 40.2  Power: 1/10W  [RES, 0603]  (hidden comment: RES 40.2 OHM 0.5% 1/10W 0603)
R?#10  Resistance: 10k  Power: 1/10W  [RES, 0603]  (hidden comment: RES 10K OHM 1% 1/10W 0603)
RT?  Resistance in Ohms @ 25°C: 10k  [RES, 0603]  (hidden comment: NTC THERMISTORS 10K 0603 SMD)
U?#1  Manufacturer Part Number: AP9101CK6-AETRG1  [SOT23-6]  (hidden comment: IC BATT PROT LI-ION 1-CELL SOT26)
U?#2  100V/V  [IC CURRENT AMPLIFIER INA240 TSSOP-8]
VM  Test Point  [Test Point]  (value not drawn)  (no BOM)

### Ports
PA2_BAT_VOLTAGE_MONITOR (out), PA3_BAT_CURRENT_MONITOR (out), PA4_BAT_TEMP_MONITOR (out), PA7_BAT_VOLTAGE_MONITOR_EN (in)

### Nets
3V3: C?#2.1 FB?.2 R?#7.1 U?#2.5(VS)
BAT_GND: C?#1.2 Q?#1.2(S) U?#1.6(VSS)
GND: C?#2.2 C?#3.2 C?#4.2 C?#5.2 C?#6.2 LED?#1.2(K) Q?#2.2(S) Q?#3.2(S) R?#4.2 R?#10.2 RT?.1 U?#2.4(GND) U?#2.7(REF1)
VBAT: R?#1.2 R?#2.1 R?#3.1 R?#6.1 U?#2.3(-IN)
VBAT_CELL: F?.1
PA2_BAT_VOLTAGE_MONITOR: C?#6.1 R?#6.2 R?#8.1 ; port PA2_BAT_VOLTAGE_MONITOR
PA3_BAT_CURRENT_MONITOR: C?#4.1 R?#5.2 ; port PA3_BAT_CURRENT_MONITOR
PA4_BAT_TEMP_MONITOR: C?#5.1 R?#7.2 RT?.2 ; port PA4_BAT_TEMP_MONITOR
PA7_BAT_VOLTAGE_MONITOR_EN: R?#9.1 ; port PA7_BAT_VOLTAGE_MONITOR_EN
NetC?#1_1: C?#1.1 R?#2.2 U?#1.5(VDD)
NetC?#3_1: C?#3.1 FB?.1 U?#2.6(REF2)
NetCO_TP: CO.TP Q?#2.1(G) U?#1.3(CO)
NetDO_TP: DO.TP Q?#1.1(G) U?#1.1(DO)
NetF?_2: F?.2 R?#1.1 U?#2.2(+IN)
NetLED?#1_1: LED?#1.1(A) R?#3.2
NetQ?#1_3: Q?#1.3(D) Q?#2.3(D)
NetQ?#3_1: Q?#3.1(G) R?#9.2 R?#10.1
NetQ?#3_3: Q?#3.3(D) R?#8.2
NetR?#4_1: R?#4.1 U?#1.2(VM) VM.TP
NetR?#5_1: R?#5.1 U?#2.8(OUTPUT)

Not connected (* = marked no-connect by the designer): U?#1 4(NC)*; U?#2 1(NC)*

### Notes on the sheet
- Overvoltage: 4.2V
  Undervoltage: 2.5V
  Discharge Overcurrent: 0.3V
  Charge Overcurrent: -0.1V
- 0.45V: 4 A (Charging)
  1.65V: 0 A
  2.85V: 4 A (Discharging)
- VBAT = ADC Reading * 1.47
- PROJECT
- DOCUMENT
- DRAWN BY
- LAST MODIFIED
- PART NUMBER
- REVISION
- SHEET
- VARIANT
- OF
- (in symbol IC CURRENT AMPLIFIER INA240 8-TSSOP) +; _
- (in symbol NTC THERMISTORS 10K 0603 SMD) -t°

### Library data of the parts
C?#1-C?#3 = CAP CER 0.1UF 50V 10% X7R 0603: as C1 on sheet MIXR Power - Connectors; Supplier 1: Digi-Key; Supplier Part Number 1: 478-5052-1-ND; Packaging: Cut Tape (CT); Part Status: Active; Operating Temperature: -55°C ~ 125°C; Ratings: -; Mounting Type: Surface Mount, MLCC; Package / Case: 0603 (1608 Metric); Size / Dimension: 0.063" L x 0.032" W (1.60mm x 0.81mm); Height - Seated (Max): -; Thickness (Max): 0.035" (0.90mm); Lead Spacing: -; Lead Style: -; ComponentLink1URL: http://datasheets.avx.com/X7RDielectric.pdf; ComponentLink1Description: http://datasheets.avx.com/X7RDielectric.pdf; Tolerance: ±10%
C?#4-C?#6 = CAP CER 10nF 50V 5% X7R 0603: 10000pF ±5% 50V Ceramic Capacitor U2J 0603 (1608 Metric); Manufacturer 1: KEMET; Manufacturer Part Number 1: C0603C103J5JAC7867; Supplier 1: Digi-Key; Supplier Part Number 1: 399-13384-1-ND; Packaging: Cut Tape (CT); Part Status: Active; Operating Temperature: -55°C ~ 125°C; Ratings: -; Failure Rate: -; Mounting Type: Surface Mount, MLCC; Package / Case: 0603 (1608 Metric); Size / Dimension: 0.063" L x 0.032" W (1.60mm x 0.80mm); Height - Seated (Max): -; Thickness (Max): 0.034" (0.87mm); Lead Spacing: -; Lead Style: -; ComponentLink1URL: http://www.kemet.com/docfinder?Partnumber=C0603C103J5JAC7867; ComponentLink1Description: http://www.kemet.com/docfinder?Partnumber=C0603C103J5JAC7867; Tolerance: ±5%
F? = FUSE 2.5A 32VDC 1206: as F1 on sheet MIXR Power - Connectors; Supplier 1: Digi-Key; Stock 1: 4995; Pricing 1: 1=0.84000, 5=0.81200, 10=0.78700, 50=0.66180, 100=0.54930, 250=0.49940, 500=0.42450, 1000=0.37455 (USD); RoHS: Yes; Mount: Surface Mount; Case/Package: 1206; Case Code (Metric): 3216; Case Code (Imperial): 1206; Housing Material: Ceramic; Min Operating Temperature: -55°C; Max Operating Temperature: 90°C; Package Quantity: 5000; Voltage Rating (AC): 32V; Voltage Rating (DC): 32V; Packaging: Tape and Reel; Working Voltage: 32V; Fuse Type: Board Mount (Cartridge Style Excluded); Length: 3.18mm; Height: 0.023inch; Width: 0.06inch; Depth: 1.52mm; Lead Free: Lead Free; ComponentLink1URL: https://datasheet.ciiva.com/303/littelfuse-fuse-466-303217.pdf?src-supplier=Digi-Key; ComponentLink1Description: https://datasheet.ciiva.com/303/littelfuse-fuse-466-303217.pdf?src-supplier=Digi-Key; ComponentLink2URL: https://datasheet.ciiva.com/18652/littelfuse-fuse-466-datasheet-pdf-18652469.pdf?src-supplier=Digi-Key; ComponentLink2Description: https://datasheet.ciiva.com/18652/littelfuse-fuse-466-datasheet-pdf-18652469.pdf?src-supplier=Digi-Key; ComponentLink3URL: https://datasheet.ciiva.com/16327/littelfuse-fuse-466-16327471.pdf?src-supplier=Future+Electronics; ComponentLink3Description: https://datasheet.ciiva.com/16327/littelfuse-fuse-466-16327471.pdf?src-supplier=Future+Electronics; Supplier Part Number 1: F6143CT-ND
FB? = FB 600 OHM 1LN 0603: FERRITE BEAD 600 OHM 0603 1LN; Manufacturer: TDK; Number of Lines: 1; Max Current Rating: 500mA; DC Resistance (DCR): 400mR; Impedance: 600R; Tolerance: 25%; Test Frequency: 100MHz; Supplier 1: Digi-Key; Supplier Part Number 1: 445-172850-1-ND; RoHS: Yes; Stock 1: 19540; Pricing 1: 1 = 0.10000, 10 = 0.07600, 25 = 0.06840, 50 = 0.05000, 100 = 0.04330, 250 = 0.03416, 500 = 0.02884, 1000 = 0.02429 (USD); Mount: Surface Mount; Case/Package: 0603; Weight: 7.1E-05oz; Case Code (Metric): 1608; Case Code (Imperial): 0603; Min Operating Temperature: -55°C; Max Operating Temperature: 125°C; Package Quantity: 4000; Packaging: Tape and Reel; Termination: SMD/SMT; Max DC Current: 500mA; Length: 0.063inch; Height: 0.037inch; Width: 0.031inch; Ratings: AEC-Q200
LED?#1 = LED RED CLEAR 2V 0603: Red 631nm LED Indication - Discrete 2V 0603 (1608 Metric); Manufacturer: Wurth Electronics Inc.; Manufacturer Part Number: 150060RS75000; Lens Color: Colorless; Millicandela Rating: 250mcd; Lens Style/Size: Rectangle with Flat Top, 1.10mm x 0.70mm; Current - Test: 20mA; Viewing Angle: 140°; Wavelength - Dominant: 625nm; Wavelength - Peak: 630nm; Supplier 1: Digi-Key; RoHS: RoHS Compliant; Category: Optoelectronics; Stock 1: 35521; Pricing 1: 1=0.21, 100=0.1617, 500=0.13964 (CAD); Packaging: Cut Tape (CT); Part Status: Active; Lens Transparency: Clear; Mounting Type: Surface Mount; Features: -; Package / Case: 0603 (1608 Metric); Supplier Device Package: 0603; Size / Dimension: 1.60mm L x 0.80mm W; Height (Max): 0.80mm; ComponentLink1URL: http://katalog.we-online.de/led/datasheet/150060RS75000.pdf; ComponentLink1Description: http://katalog.we-online.de/led/datasheet/150060RS75000.pdf; Supplier Part Number 1: 732-4978-1-ND
Q?#1-Q?#3 = MOSFET N-CH 30V 6.2A 0.9W SOT-23: N-Channel 30V 6.2A (Ta) 900mW (Ta) Surface Mount SOT-23; Manufacturer: Diodes; Manufacturer Part Number: DMN3023L-7; Rds On Max: 25mR; Input Capacitance: 873pF; Supplier 1: Digi-Key; Stock 1: 38246; Pricing 1: 1=0.47, 10=0.368, 100=0.2529, 500=0.1734, 1000=0.1301 (USD); Mount: Surface Mount; Case/Package: TO-236-3; Min Operating Temperature: -55°C; Max Operating Temperature: 150°C; Packaging: Tape and Reel; Drain to Source Voltage (Vdss): 30V; Continuous Drain Current (ID): 6.2A; Max Power Dissipation: 900mW; ComponentLink1URL: https://www.diodes.com/assets/Datasheets/DMN3023L.pdf; ComponentLink1Description: https://www.diodes.com/assets/Datasheets/DMN3023L.pdf; ComponentLink2URL: http://www.mouser.com/ds/2/115/DMN3023L-959533.pdf; ComponentLink2Description: http://www.mouser.com/ds/2/115/DMN3023L-959533.pdf; Supplier Part Number 1: DMN3023L-7DICT-ND
R?#1 = RES 0.003 OHM 1% 1.5W 2010: 0.003 Ohm ±1% 1.5W Chip Resistor 2010 (5025 Metric) Current Sense, Moisture Resistant Metal Foil; Manufacturer 1: Stackpole Electronics Inc.; Manufacturer Part Number 1: CSNL2010FT3L00; Description 1: RES SMD 0.003 OHM 1% 1.5W 2010; Temperature Coefficient: ±50ppm/°C; Supplier 1: Digi-Key; Supplier Part Number 1: CSNL2010FT3L00CT-ND; RoHS: RoHS Compliant; Category: Resistors; Stock 1: 18532; Pricing 1: 1=1.02, 10=0.844, 25=0.7232, 50=0.6508, 100=0.5665, 250=0.5062, 500=0.4098, 1000=0.33145 (CAD); Packaging: Cut Tape (CT); Part Status: Active; Composition: Metal Foil; Features: Current Sense, Moisture Resistant; Operating Temperature: -55°C ~ 170°C; Package / Case: 2010 (5025 Metric); Supplier Device Package: 2010; Size / Dimension: 0.200" L x 0.100" W (5.08mm x 2.54mm); Height - Seated (Max): 0.041" (1.04mm); Failure Rate: -; ComponentLink1URL: https://www.seielect.com/Catalog/SEI-csnl.pdf; ComponentLink1Description: https://www.seielect.com/Catalog/SEI-csnl.pdf
R?#2 R?#5 = RES 330 OHM 1% 1/10W 0603: as R29 on sheet MIXR Power - Battery Charging; Supplier 1: Digi-Key; Supplier Part Number 1: A129682CT-ND; RoHS: No; Stock 1: 87700; Pricing 1: 1 = 0.10000, 10 = 0.03300, 100 = 0.01320, 1000 = 0.00595, 2500 = 0.00516 (USD); ComponentLink1URL: http://www.te.com/commerce/DocumentDelivery/DDEController?Action=srchrtrv&DocNm=1773204-3&DocType=DS&DocLang=English&src-supplier=Digi-Key; ComponentLink1Description: http://www.te.com/commerce/DocumentDelivery/DDEController?Action=srchrtrv&DocNm=1773204-3&DocType=DS&DocLang=English&src-supplier=Digi-Key; ComponentLink2URL: https://www.te.com/commerce/DocumentDelivery/DDEController?Action=srchrtrv&DocNm=1773204-3&DocType=DS&DocLang=English&src-supplier=Digi-Key; ComponentLink2Description: https://www.te.com/commerce/DocumentDelivery/DDEController?Action=srchrtrv&DocNm=1773204-3&DocType=DS&DocLang=English&src-supplier=Digi-Key
R?#3 R?#6 = RES 4.7K OHM 1% 1/10W 0603: 4.7k Ohm ±1% 0.1W, 1/10W Chip Resistor 0603 (1608 Metric) Moisture Resistant Thick Film; Manufacturer 1: Yageo; Manufacturer Part Number 1: RC0603FR-074K7L; Description 1: RES SMD 4.7K OHM 1% 1/10W 0603; Temperature Coefficient: ±100ppm/°C; Supplier 1: Digi-Key; Supplier Part Number 1: 311-4.70KHRCT-ND; RoHS: RoHS Compliant; Category: Resistors; Stock 1: 3487566; Pricing 1: 1=0.16, 10=0.022, 100=0.0089, 1000=0.00402, 2500=0.00349 (CAD); Packaging: Cut Tape (CT); Part Status: Active; Composition: Thick Film; Features: Moisture Resistant; Operating Temperature: -55°C ~ 155°C; Package / Case: 0603 (1608 Metric); Supplier Device Package: 0603; Size / Dimension: 0.063" L x 0.031" W (1.60mm x 0.80mm); Height - Seated (Max): 0.022" (0.55mm); Failure Rate: -; ComponentLink1URL: http://www.yageo.com/documents/recent/PYu-RC_Group_51_RoHS_L_7.pdf; ComponentLink1Description: http://www.yageo.com/documents/recent/PYu-RC_Group_51_RoHS_L_7.pdf; Tolerance: ±1%
R?#4 = RES 2.7K OHM 1% 1/10W 0603: 2.7 kOhms ±1% 0.1W, 1/10W Chip Resistor 0603 (1608 Metric) Automotive AEC-Q200, Moisture Resistant Thick Film; Manufacturer: TE Connectivity; Manufacturer Part Number: CRGCQ0603F2K7; Supplier 1: Digi-Key; Supplier Part Number 1: A129693CT-ND; RoHS: No; Stock 1: 137187; Pricing 1: 1 = 0.10000, 10 = 0.03300, 100 = 0.01320, 1000 = 0.00595, 2500 = 0.00516 (USD); ComponentLink1URL: http://www.te.com/commerce/DocumentDelivery/DDEController?Action=srchrtrv&DocNm=1773204-3&DocType=DS&DocLang=English&src-supplier=Digi-Key; ComponentLink1Description: http://www.te.com/commerce/DocumentDelivery/DDEController?Action=srchrtrv&DocNm=1773204-3&DocType=DS&DocLang=English&src-supplier=Digi-Key; ComponentLink2URL: https://www.te.com/commerce/DocumentDelivery/DDEController?Action=srchrtrv&DocNm=1773204-3&DocType=DS&DocLang=English&src-supplier=Digi-Key; ComponentLink2Description: https://www.te.com/commerce/DocumentDelivery/DDEController?Action=srchrtrv&DocNm=1773204-3&DocType=DS&DocLang=English&src-supplier=Digi-Key
R?#7 R?#8 R?#10 = RES 10K OHM 1% 1/10W 0603: as R23 on sheet MIXR Power - Battery Charging; Supplier 1: Digi-Key; Supplier Part Number 1: 311-10.0KHRCT-ND; Packaging: Cut Tape (CT); Part Status: Active; Composition: Thick Film; Operating Temperature: -55°C ~ 155°C; Package / Case: 0603 (1608 Metric); Supplier Device Package: 0603; Size / Dimension: 0.063" L x 0.031" W (1.60mm x 0.80mm); Height - Seated (Max): 0.022" (0.55mm); Failure Rate: -; ComponentLink1URL: http://www.yageo.com/documents/recent/PYu-RC_Group_51_RoHS_L_7.pdf; ComponentLink1Description: http://www.yageo.com/documents/recent/PYu-RC_Group_51_RoHS_L_7.pdf; Tolerance: ±1%
R?#9 = RES 40.2 OHM 0.5% 1/10W 0603: as R31 on sheet MIXR Power - Battery Charging; Supplier 1: Digi-Key; Supplier Part Number 1: 311-2576-1-ND; Packaging: Cut Tape (CT); Part Status: Active; Composition: Thin Film; Operating Temperature: -55°C ~ 155°C; Package / Case: 0603 (1608 Metric); Supplier Device Package: 0603; Size / Dimension: 0.063" L x 0.031" W (1.60mm x 0.80mm); Height - Seated (Max): 0.022" (0.55mm); Failure Rate: -; ComponentLink1URL: http://www.yageo.com/documents/recent/PYu-RT_1-to-0.01_RoHS_L_7.pdf; ComponentLink1Description: http://www.yageo.com/documents/recent/PYu-RT_1-to-0.01_RoHS_L_7.pdf; Tolerance: ±0.5%
RT? = NTC THERMISTORS 10K 0603 SMD: NTC THERMISTORS 10KOHM 1608 SMD; Manufacturer: Murata Electronics North America; Manufacturer Part Number: NCU18XH103F60RB; Resistance Tolerance: ±1%; B25/50: 3380K; B25/85: 3434K; B25/100: 3455K; Supplier 1: Digi-Key; RoHS: Request Inventory Verification; Category: Sensors, Transducers; Stock 1: 0; Pricing 1: 4000=0.06771, 8000=0.05974, 12000=0.05775, 20000=0.05675, 28000=0.05576 (CAD); Packaging: Tape & Reel (TR); Part Status: Active; B Value Tolerance: ±1%; B0/50: -; B25/75: -; Operating Temperature: -40°C ~ 125°C; Length - Lead Wire: -; Mounting Type: Surface Mount; Package / Case: 0603 (1608 Metric); ComponentLink1URL: https://www.murata.com/~/media/webrenewal/support/library/catalog/products/thermistor/r03e.ashx; ComponentLink1Description: https://www.murata.com/~/media/webrenewal/support/library/catalog/products/thermistor/r03e.ashx; Supplier Part Number 1: 490-16279-2-ND
U?#1 = IC BATT PROT LI-ION 1-CELL SOT26: Battery Battery Protection IC Lithium Ion/Polymer SOT-26; Manufacturer: Diodes; Number of Cells: 1; Fault Protection: Over Current; Supplier 1: Digi-Key; Supplier Part Number 1: AP9101CK6-AETRG1DICT-ND; Stock 1: 5917; Pricing 1: 1 = 0.45000, 10 = 0.36300, 100 = 0.24720, 500 = 0.18540, 1000 = 0.13905 (USD); RoHS: Yes; Case/Package: SOT-23-6; Min Operating Temperature: -40°C; Max Operating Temperature: 85°C; ComponentLink1URL: https://www.diodes.com/assets/Datasheets/AP9101C.pdf?src-supplier=Digi-Key; ComponentLink1Description: https://www.diodes.com/assets/Datasheets/AP9101C.pdf?src-supplier=Digi-Key
U?#2 = IC CURRENT AMPLIFIER INA240 8-TSSOP: Current Sense Amplifier 1 Circuit 8-TSSOP; Manufacturer 1: Texas Instruments; Manufacturer Part Number 1: INA240A3PWR; Description 1: IC AMP CURRENT SENSE 8-TSSOP; Slew Rate: 2 V/µs; Current - Supply: 1.8mA; Voltage - Supply, Single/Dual (±): 2.7 V ~ 5.5 V; Supplier 1: Digi-Key; Supplier Part Number 1: 296-45090-1-ND; RoHS: RoHS Compliant; Category: Integrated Circuits (ICs); Stock 1: 1286; Pricing 1: 1=3.79, 10=3.397, 100=2.7311, 500=2.24388, 1000=1.85921 (CAD); Packaging: Cut Tape (CT); Part Status: Active; Amplifier Type: Current Sense; Output Type: -; Operating Temperature: -40°C ~ 125°C; Mounting Type: Surface Mount; Package / Case: 8-TSSOP (0.173", 4.40mm Width); Supplier Device Package: 8-TSSOP; ComponentLink1URL: http://www.ti.com/lit/ds/symlink/ina240.pdf; ComponentLink1Description: http://www.ti.com/lit/ds/symlink/ina240.pdf